# EAGLE schematic MainBoard (EAGLE 9.6.2)
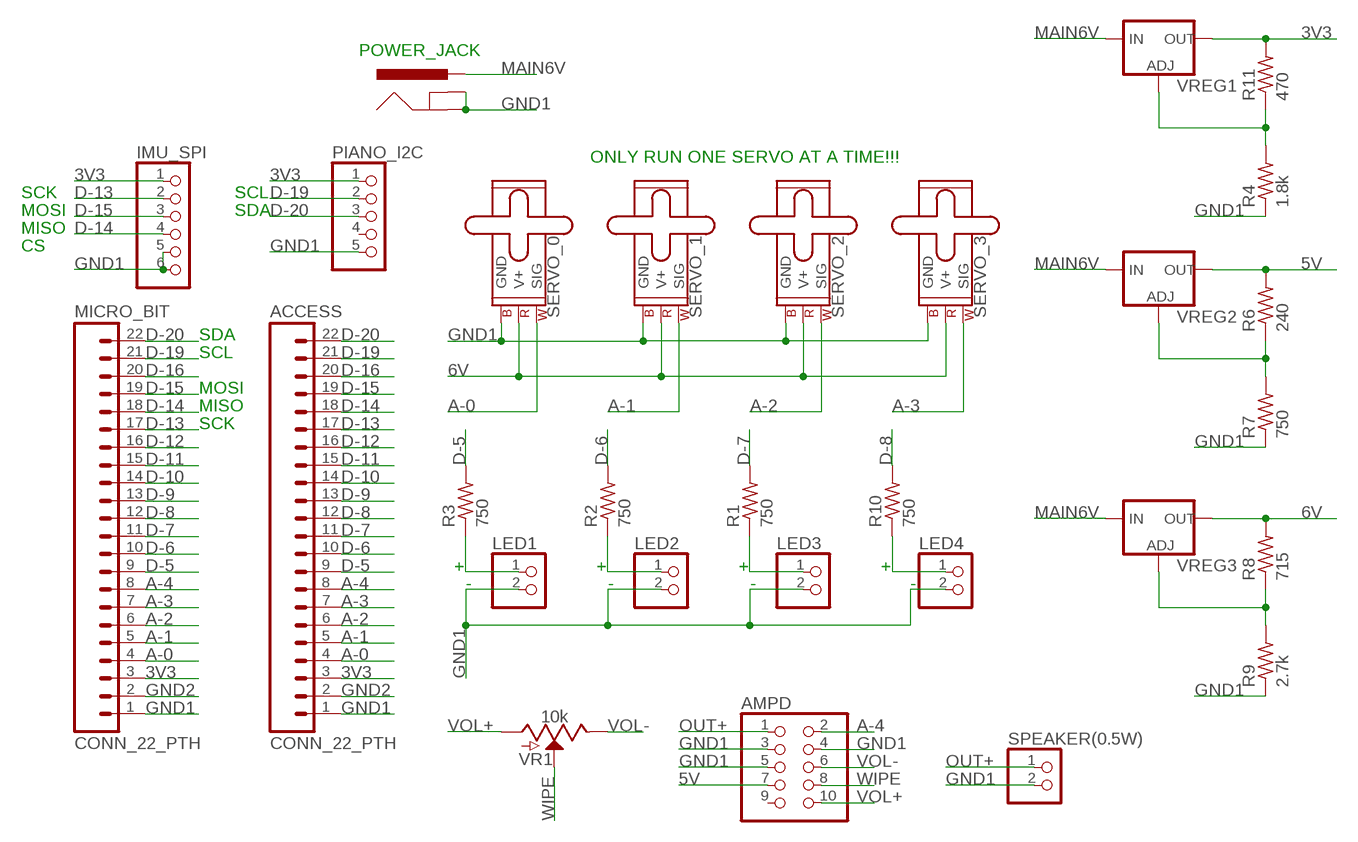
[diagram p0: schematic, sheet 1]

## Parts
ACCESS  CONN_22_PTH  [1X22]
AMPD  PINHD-2X5  [2X05]
IMU_SPI  PINHD-1X6  [1X06]
LED1  PINHD-1X2  [1X02]
LED2  PINHD-1X2  [1X02]
LED3  PINHD-1X2  [1X02]
LED4  PINHD-1X2  [1X02]
MICRO_BIT  CONN_22_PTH  [1X22]
PIANO_I2C  PINHD-1X5  [1X05]
POWER_JACK  POWER_JACKPTH_BREAD  [POWER_JACK_PTH_BREAD]
R1  750  R-US_0207/10  [0207/10]
R2  750  R-US_0207/10  [0207/10]
R3  750  R-US_0207/10  [0207/10]
R4  1.8k  R-US_0207/10  [0207/10]
R6  240  R-US_0207/10  [0207/10]
R7  750  R-US_0207/10  [0207/10]
R8  715  R-US_0207/10  [0207/10]
R9  2.7k  R-US_0207/10  [0207/10]
R10  750  R-US_0207/10  [0207/10]
R11  470  R-US_0207/10  [0207/10]
SERVO_0  SERVO  [1X03]
SERVO_1  SERVO  [1X03]
SERVO_2  SERVO  [1X03]
SERVO_3  SERVO  [1X03]
SPEAKER(0.5W)  PINHD-1X2  [1X02]
VR1  10k  POTENTIOMETER-PTH-9MM-1/20W-20%  [POT-PTH-ALPS]
VREG1  V_REG_317SINK  [TO220-ADJ]
VREG2  V_REG_317SINK  [TO220-ADJ]
VREG3  V_REG_317SINK  [TO220-ADJ]

## Nets
3V3: ACCESS.3 IMU_SPI.1 MICRO_BIT.3 PIANO_I2C.1 R11.2 VREG1.OUT
5V: AMPD.7 R6.2 VREG2.OUT
6V: R8.2 SERVO_0.2(V+) SERVO_1.2(V+) SERVO_2.2(V+) SERVO_3.2(V+) VREG3.OUT
A-0: ACCESS.4 MICRO_BIT.4 SERVO_0.1(SIG)
A-1: ACCESS.5 MICRO_BIT.5 SERVO_1.1(SIG)
A-2: ACCESS.6 MICRO_BIT.6 SERVO_2.1(SIG)
A-3: ACCESS.7 MICRO_BIT.7 SERVO_3.1(SIG)
A-4: ACCESS.8 AMPD.2 MICRO_BIT.8
D-5: ACCESS.9 MICRO_BIT.9 R3.2
D-6: ACCESS.10 MICRO_BIT.10 R2.2
D-7: ACCESS.11 MICRO_BIT.11 R1.2
D-8: ACCESS.12 MICRO_BIT.12 R10.2
D-9: ACCESS.13 MICRO_BIT.13
D-10: ACCESS.14 MICRO_BIT.14
D-11: ACCESS.15 MICRO_BIT.15
D-12: ACCESS.16 MICRO_BIT.16
D-13: ACCESS.17 IMU_SPI.2 MICRO_BIT.17
D-14: ACCESS.18 IMU_SPI.4 MICRO_BIT.18
D-15: ACCESS.19 IMU_SPI.3 MICRO_BIT.19
D-16: ACCESS.20 MICRO_BIT.20
D-19: ACCESS.21 MICRO_BIT.21 PIANO_I2C.2
D-20: ACCESS.22 MICRO_BIT.22 PIANO_I2C.3
GND1: ACCESS.1 AMPD.3 AMPD.4 AMPD.5 IMU_SPI.5 IMU_SPI.6 LED1.2 LED2.2 LED3.2 LED4.2 MICRO_BIT.1 PIANO_I2C.5 POWER_JACK.GND POWER_JACK.GNDBREAK R4.1 R7.1 R9.1 SERVO_0.3(GND) SERVO_1.3(GND) SERVO_2.3(GND) SERVO_3.3(GND) SPEAKER(0.5W).2
GND2: ACCESS.2 MICRO_BIT.2
MAIN6V: POWER_JACK.PWR VREG1.IN VREG2.IN VREG3.IN
N$1: LED1.1 R3.1
N$2: LED2.1 R2.1
N$3: LED3.1 R1.1
N$4: LED4.1 R10.1
N$6: R4.2 R11.1 VREG1.ADJ
N$8: R6.1 R7.2 VREG2.ADJ
N$10: R8.1 R9.2 VREG3.ADJ
OUT+: AMPD.1 SPEAKER(0.5W).1
VOL+: AMPD.10 VR1.P$3(A)
VOL-: AMPD.6 VR1.P$1(E)
WIPE: AMPD.8 VR1.P$2(S)
Unconnected: AMPD.9 PIANO_I2C.4

## Notes on the sheet
- POWER_JACK
- ONLY RUN ONE SERVO AT A TIME!!!
- SCK | SCL
- MOSI | SDA
- MISO
- CS
- SDA
- SCL
- MOSI
- MISO
- SCK
- + | + | + | +
- - | - | - | -

## Library data of the parts
ACCESS MICRO_BIT = SparkFun-Connectors:CONN_22: Standard 22-pin 0.1" header; PROD_ID: CONN-13453
AMPD = pinhead:PINHD-2X5: PIN HEADER
IMU_SPI = pinhead:PINHD-1X6: PIN HEADER
LED1-LED4 SPEAKER(0.5W) = pinhead:PINHD-1X2: PIN HEADER
PIANO_I2C = pinhead:PINHD-1X5: PIN HEADER
POWER_JACK = SparkFun-Connectors:POWER_JACK: Power Jack Connector This is the standard 5.5mm barrel jack for power. The PTH is the most common, proven, reliable, footprint. The Slot footprint only works if the mill layer is transmitted to the PCB fab house so be warned. Here are the connectors we sell at SparkFun: DC Barrel Power Jack/Connector <https://www.sparkfun.com/products/119> (PRT-00119) DC Barrel Power Jack/Connector (SMD) <https://www.sparkfun.com/products/12748> (PRT-12748) DC Barrel Jack Adapter - Breadboard Compatible <https://www.sparkfun.com/products/10811> (PRT-10811) It is used on this SparkFun product (and many, many others): SparkFun RedBoard - Programmed with Arduino <https://www.sparkfun.com/products/12757> (DEV-12757) Also, if you need a mating power supply or connector, please check these out: Wall Adapter Power Supply - 9VDC 650mA <https://www.sparkfun.com/products/298> (TOL-00298) DC Barrel Jack Adapter - Male <https://www.sparkfun.com/products/10287> (PRT-10287); PROD_ID: COMP-13253
R1-R4 R6-R11 = rcl:R-US_: RESISTOR, American symbol; SPICEPREFIX: R
SERVO_0 SERVO_1-SERVO_3 = SparkFun-Electromechanical:SERVO: Servo Motor 3-pin connector for a standard servo motor (voltage supply, ground, and control signal.) SparkFun Products Servo - Generic (Sub-Micro Size) <https://www.sparkfun.com/products/9065> (ROB-09065) Servo - Generic High Torque Continuous Rotation (Standard Size) <https://www.sparkfun.com/products/9347> (ROB-09347) Servo - Generic High Torque (Standard Size) <https://www.sparkfun.com/products/11965> (ROB-11965)
VR1 = SparkFun-Resistors:POTENTIOMETER: Potentiometer (Pot) Three-terminal potentiometers, with an adjustable wiper and two adjustable resistors. A pot can be used to create a configurable voltage divider, or as a variable resistor. Variants ALPS_POT and ALPS_POT_KIT - PTH, breadboard compatible, 9mm square pots Rotary Potentiometer - Linear (10k ohm) <https://www.sparkfun.com/products/9288> (COM-09288) The KIT variant exposes copper on only one side of the PTH pad, so the part can only be assembled on one side of the PCB. Useful for beginner soldering kits.; PROD_ID: RES-09177; SF_SKU: COM-09288
VREG1-VREG3 = SparkFun-IC-Power:V_REG_317: Voltage Regulator Standard LM317 adjustable voltage regulator. AOI (Adjust Output Input). Google 'LM317 Calculator' for easy to use app to get the two resistor values needed. 240/720 for 5V output. 240/390 for 3.3V output. Spark Fun Electronics SKU : COM-00527